# Altium schematic sheet Gate_driver.SchDoc
size A
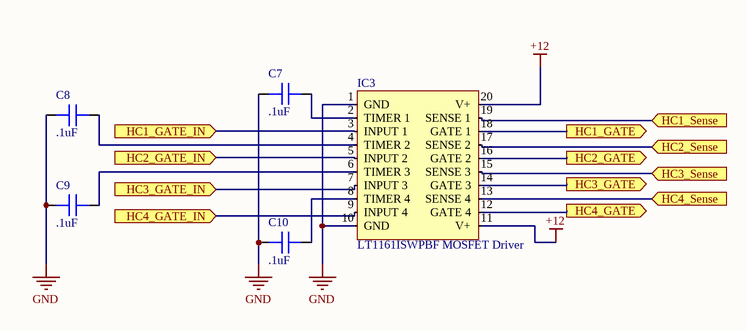
[diagram p0: Gate_driver.SchDoc]

## Parts
C7  capacitance: .1uF  [0603]  (hidden comment: capacitor)
C8  capacitance: .1uF  [0603]  (hidden comment: capacitor)
C9  capacitance: .1uF  [0603]  (hidden comment: capacitor)
C10  capacitance: .1uF  [0603]  (hidden comment: capacitor)
IC3  LT1161ISWPBF MOSFET Driver  [SO-20]

## Ports
HC1_GATE (out), HC1_GATE_IN (in), HC1_Sense (in), HC2_GATE (out), HC2_GATE_IN (in), HC2_Sense (in), HC3_GATE (out), HC3_GATE_IN (in), HC3_Sense (in), HC4_GATE (out), HC4_GATE_IN (in), HC4_Sense (in)

## Nets
+12: IC3.11(V+) IC3.20(V+)
GND: C7.1 C8.1 C9.1 C10.1 IC3.1(GND) IC3.10(GND)
HC1_GATE: IC3.18(GATE_1) ; port HC1_GATE
HC1_GATE_IN: IC3.3(INPUT_1) ; port HC1_GATE_IN
HC1_Sense: IC3.19(SENSE_1) ; port HC1_Sense
HC2_GATE: IC3.16(GATE_2) ; port HC2_GATE
HC2_GATE_IN: IC3.5(INPUT_2) ; port HC2_GATE_IN
HC2_Sense: IC3.17(SENSE_2) ; port HC2_Sense
HC3_GATE: IC3.14(GATE_3) ; port HC3_GATE
HC3_GATE_IN: IC3.7(INPUT_3) ; port HC3_GATE_IN
HC3_Sense: IC3.15(SENSE_3) ; port HC3_Sense
HC4_GATE: IC3.12(GATE_4) ; port HC4_GATE
HC4_GATE_IN: IC3.9(INPUT_4) ; port HC4_GATE_IN
HC4_Sense: IC3.13(SENSE_4) ; port HC4_Sense
NetC7_2: C7.2 IC3.2(TIMER_1)
NetC8_2: C8.2 IC3.4(TIMER_2)
NetC9_2: C9.2 IC3.6(TIMER_3)
NetC10_2: C10.2 IC3.8(TIMER_4)

## Library data of the parts
C7-C10 = 1: Generic 0603 capacitor; id: 1; voltage: 50; dielectric: Ceramic; percent tolerance: 10; name: 0603 Capacitor; ESR: 1; package: 0603; quantity: 0
IC3 = 16: Manufacturer_id: 1; idIC_Misc: 16; Created_By: Eunice Bernardo; Drawer_id: 1; Name: LT1161ISWPBF MOSFET Driver; Created_Date: 10/27/2018